# Altium schematic sheet buzzer.SchDoc
size 297 x 209 mm; DrawnBy: Supun; Engineer: Supun; Organization: C3
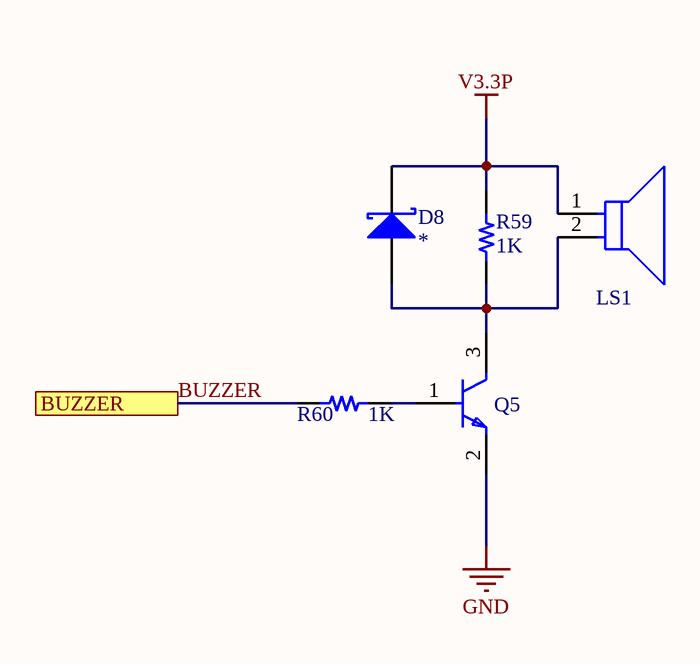
[diagram p0: buzzer.SchDoc]

## Parts
D8  *  [Rohm_TUMD2M_MFG]
LS1  Buzzer  [Murata_0_MFG]  (value not drawn)
Q5  N Transistor  [ON_Semiconductor_MA03D_MFG]  (value not drawn)
R59  1K  [RES 0603_1608]
R60  1K  [RES 0603_1608]

## Ports
BUZZER

## Nets
GND: Q5.2(E)
V3.3P: D8.1(K) LS1.1 R59.2
BUZZER: R60.1 ; port BUZZER
NetD8_2: D8.2(A) LS1.2 Q5.3(C) R59.1
NetQ5_1: Q5.1(B) R60.2

## Notes on the sheet
- Title
- Size:
- Date:
- A4
- Number:
- Time:
- Revision:
- Sheet
- of
- File:

## Library data of the parts
D8 = Schottky Diode: Schottky Barrier Rectifier, 40 V Maximum DC Blocking Voltage, -65 to 125 degC, 2-Pin SMA Case, RoHS; MF: Toshiba; MP: CUHS20F30,H3F; ComponentLink1Description: Manufacturer URL; ComponentLink2Description: Datasheet; ComponentLink3URL: http://www.vishay.com/docs/88746/ss12.pdf; ComponentLink3Description: Package Specification; ComponentLink1URL: http://www.vishay.com/; ComponentLink2URL: http://www.vishay.com/docs/88746/ss12.pdf; Value: *; Link: https://www.mouser.com/ProductDetail/Toshiba/CUHS20F30H3F?qs=PqoDHHvF6497%2FIoWy79A3w%3D%3D
LS1 = Piezo Buzzers: SPEAK AUDIO PIEZO TRANSDUCER 30V TH; MP: PS1240P02BT; MF: TDK; Voltage - Rated: 3V; Frequency: 4kHz; helpURL: https://upverter.com/upn/revision/4162df88e1b3dc74/; ComponentLink2Description: Datasheet; Temperature: -10°C to +70°C; Package: THT_12.2x6.5mm; Supplier 2: Mouser; Price: 0.40357881271; Supplier 1: Digi-Key; ComponentLink1URL: https://upverter.com/upn/revision/4162df88e1b3dc74/; Supplier Part Number 2: 810-PS1240P02BT; Supplier Part Number 1: 445-2525-1-ND; ComponentLink1Description: Upverter; ComponentLink2URL: https://upverter.com/datasheet/1aedf42020f7a0ec4f8097831a18cda881c6a5a0.pdf; RoHS: TRUE; Mouser Part Number: 810-PS1240P02BT; Voltage Range: 30V; Temperature Range High: +70°C; Digikey Description: SPEAK AUDIO PIEZO TRANSDUCER 30V TH; Digikey Part Number: 445-2525-1-ND; Lead Free: yes; Temperature Range Low: -10°C; Value: *; Link: https://www.mouser.com/ProductDetail/TDK/PS1240P02BT?qs=d7g9p1yFhWaZXSY9MjKMkw%3D%3D
Q5 = NPN: Small Signal Transistor, Bipolar (BJT), Single, NPN; MF: Nexperia; MP: MMBT3904,215; Value: N Transistor; Link: https://www.mouser.com/ProductDetail/Nexperia/MMBT3904215?qs=LOCUfHb8d9s%2FW6hzAJGDbw%3D%3D
R59 R60 = Resistor: SMT Resistor; MF: YAGEO; MP: AC0603FR-071KL; Value: 1K; Link: https://www.mouser.com/ProductDetail/YAGEO/AC0603FR-071KL?qs=UoPT7wUmgYJx4gI0q%252BcIRQ%3D%3D